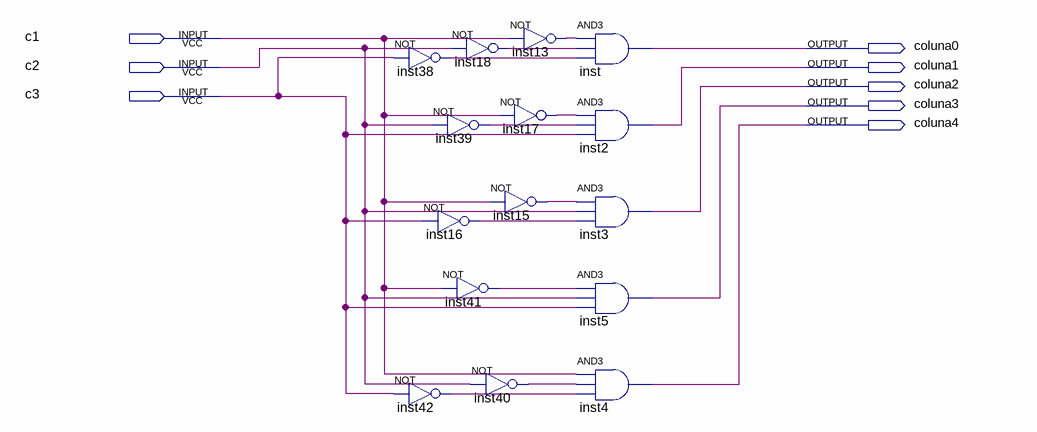
[diagram p0: schematic sheet]
// Quartus schematic decodificador6bits_colunas.bdf as structural Verilog: 15 symbols, 8 pins
module decodificador6bits_colunas (
  input  c1,
  input  c2,
  input  c3,
  output coluna0,
  output coluna1,
  output coluna2,
  output coluna3,
  output coluna4
);

  wire inst13_out, inst15_out, inst16_out, inst17_out, inst18_out, inst38_out, inst39_out, inst40_out,
       inst41_out, inst42_out;

  not inst38 (inst38_out, c3);
  not inst42 (inst42_out, c3);
  not inst18 (inst18_out, c2);
  not inst39 (inst39_out, c2);
  not inst16 (inst16_out, c3);
  not inst41 (inst41_out, c1);
  not inst40 (inst40_out, c2);
  not inst13 (inst13_out, c1);
  not inst17 (inst17_out, c1);
  not inst15 (inst15_out, c1);
  and inst (coluna0, inst13_out, inst18_out, inst38_out);
  and inst2 (coluna1, inst17_out, inst39_out, c3);
  and inst3 (coluna2, inst15_out, c2, inst16_out);
  and inst5 (coluna3, inst41_out, c2, c3);
  and inst4 (coluna4, c1, inst40_out, inst42_out);
endmodule
